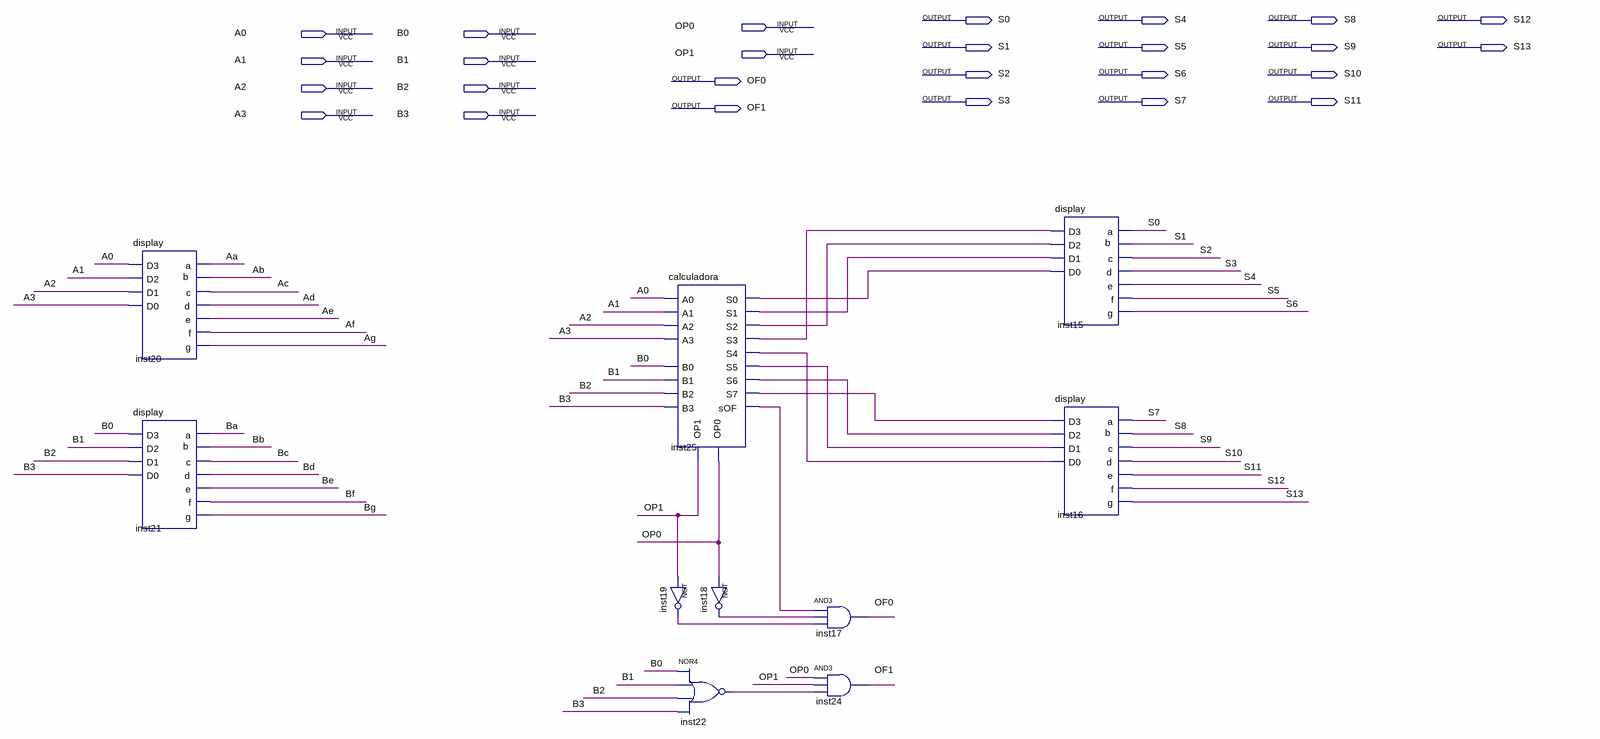
[diagram p0: schematic sheet]
// Quartus schematic ULA.bdf as structural Verilog: 10 symbols, 26 pins
module ULA (
  input  OP0,
  input  A0,
  input  B0,
  input  OP1,
  input  A1,
  input  B1,
  input  A2,
  input  B2,
  input  A3,
  input  B3,
  output S0,
  output S4,
  output S8,
  output S12,
  output S1,
  output S5,
  output S9,
  output S13,
  output S2,
  output S6,
  output S10,
  output OF0,
  output S3,
  output S7,
  output S11,
  output OF1
);

  wire Aa, Ab, Ac, Ad, Ae, Af, Ag, Ba, Bb, Bc, Bd, Be, Bf, Bg, inst18_out, inst19_out, inst22_out, inst25_s0,
       inst25_s1, inst25_s2, inst25_s3, inst25_s4, inst25_s5, inst25_s6, inst25_s7, inst25_sof;

  display inst20 (.D3(A0), .D2(A1), .D1(A2), .D0(A3), .b(Ab), .a(Aa), .c(Ac), .d(Ad), .e(Ae), .f(Af), .g(Ag));
  display inst21 (.D3(B0), .D2(B1), .D1(B2), .D0(B3), .b(Bb), .a(Ba), .c(Bc), .d(Bd), .e(Be), .f(Bf), .g(Bg));
  calculadora inst25 (
    .A0(A0), .OP0(OP0), .A1(A1), .OP1(OP1), .A2(A2), .A3(A3), .B0(B0), .B1(B1), .B2(B2), .B3(B3),
    .S0(inst25_s0), .S1(inst25_s1), .S2(inst25_s2), .sOF(inst25_sof), .S3(inst25_s3), .S4(inst25_s4),
    .S5(inst25_s5), .S6(inst25_s6), .S7(inst25_s7));
  not inst19 (inst19_out, OP1);
  nor inst22 (inst22_out, B0, B1, B2, B3);
  not inst18 (inst18_out, OP0);
  and inst17 (OF0, inst25_sof, inst18_out, inst19_out);
  and inst24 (OF1, OP0, OP1, inst22_out);
  display inst15 (
    .D3(inst25_s3), .D2(inst25_s2), .D1(inst25_s1), .D0(inst25_s0), .b(S1), .a(S0), .c(S2), .d(S3), .e(S4),
    .f(S5), .g(S6));
  display inst16 (
    .D3(inst25_s7), .D2(inst25_s6), .D1(inst25_s5), .D0(inst25_s4), .b(S8), .a(S7), .c(S9), .d(S10), .e(S11),
    .f(S12), .g(S13));
endmodule
